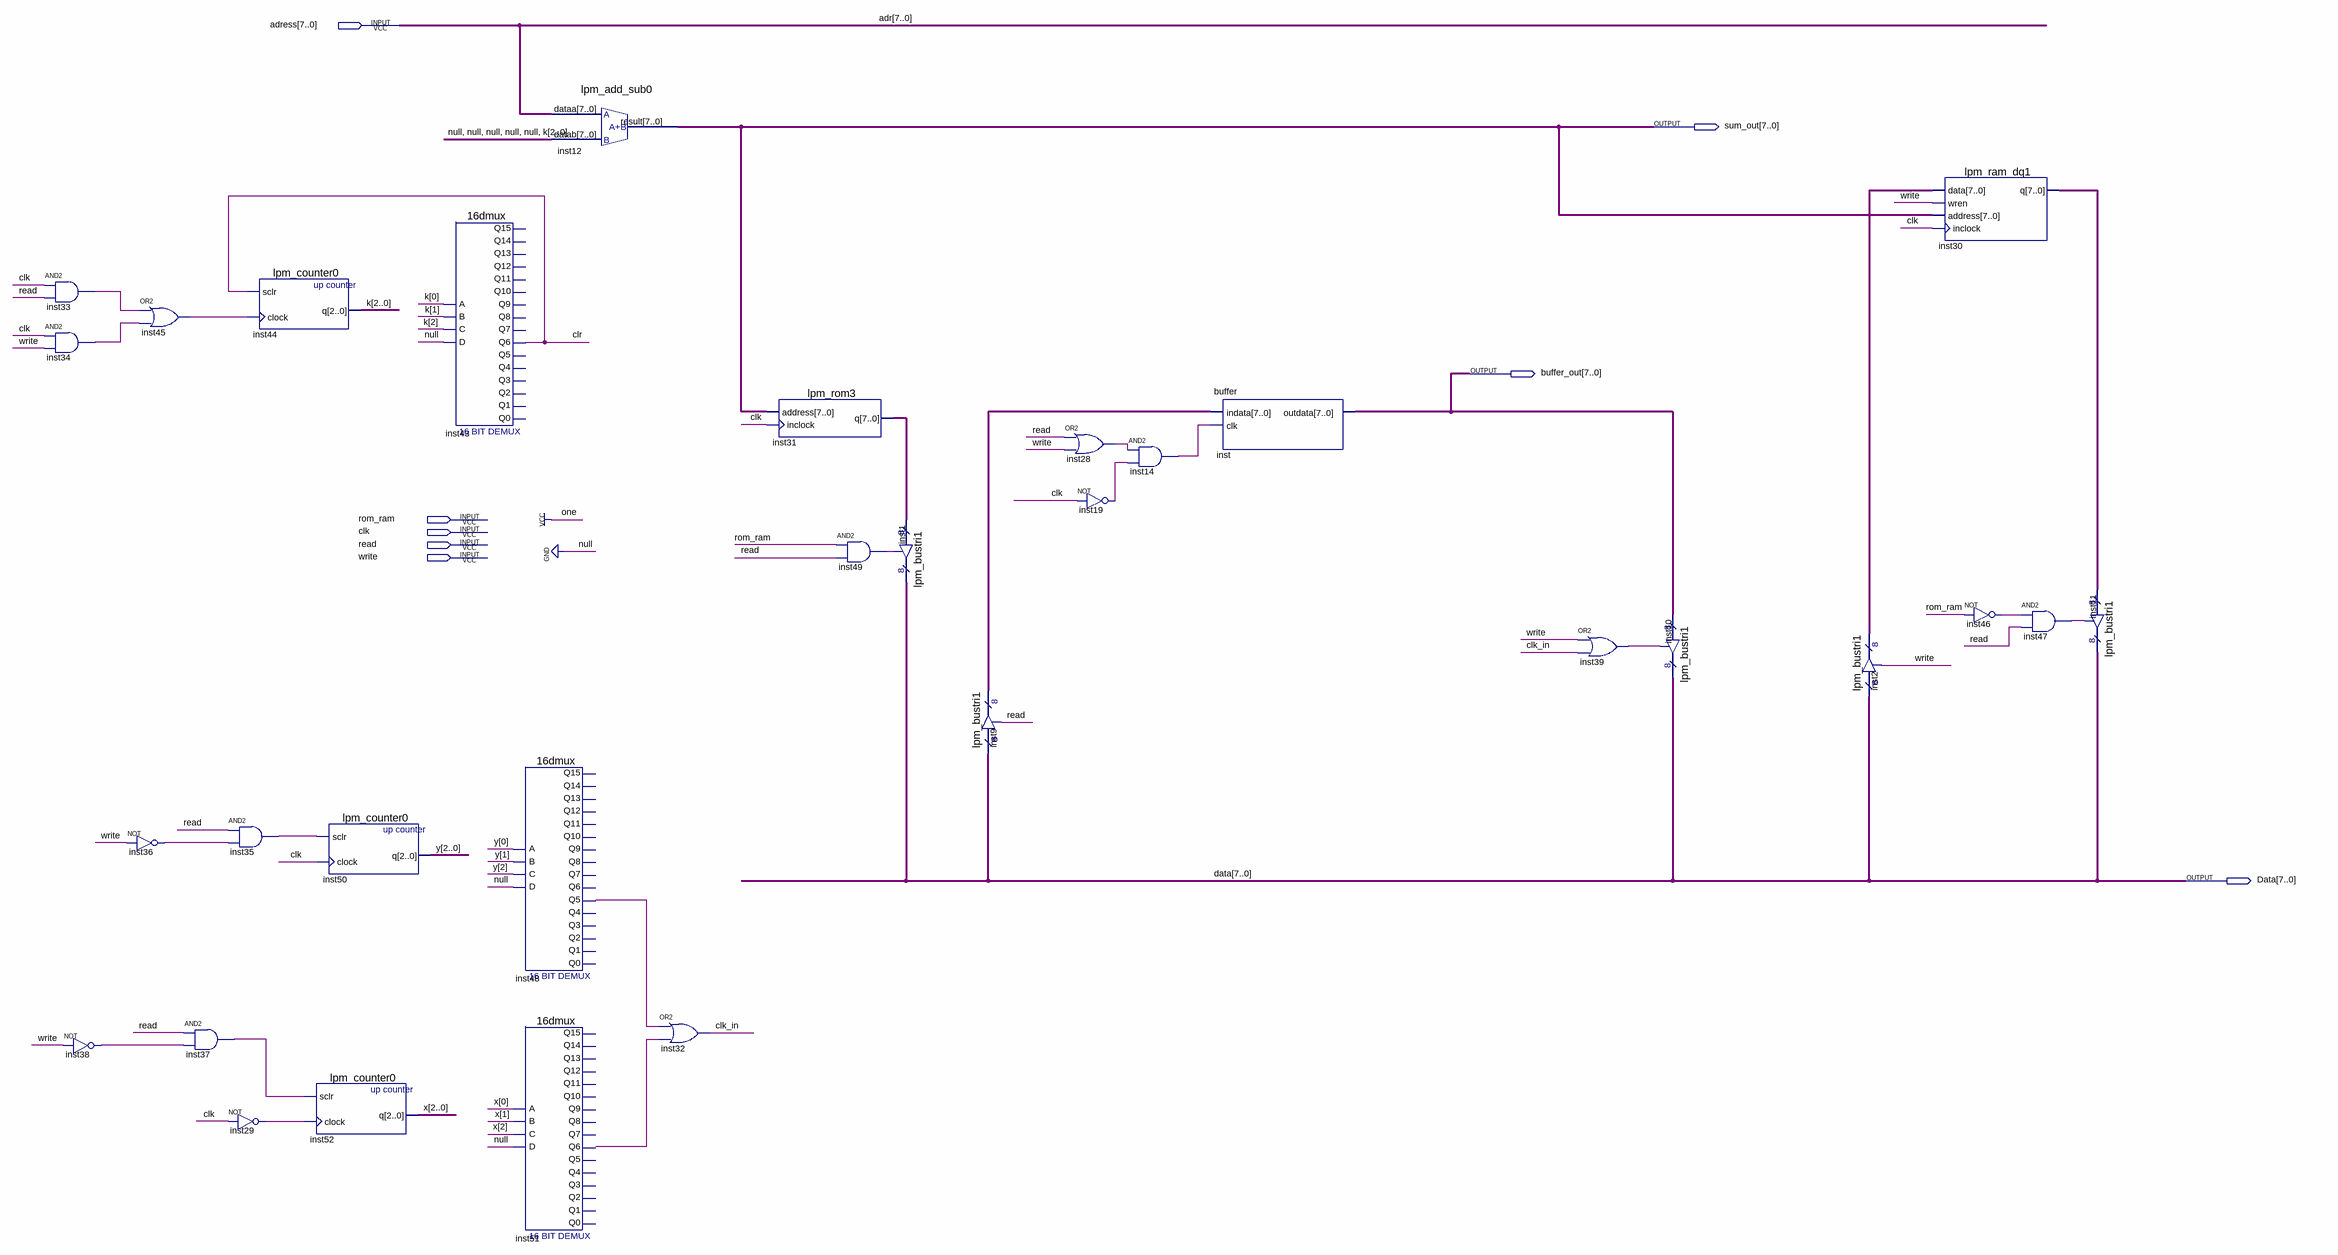
[diagram p0: schematic sheet]
// Quartus schematic lab3.bdf as structural Verilog: 31 symbols, 8 pins
module lab3 (
  input  [7:0] adress,
  input  rom_ram,
  input  clk,
  input  read,
  input  write,
  output [7:0] sum_out,
  output [7:0] buffer_out,
  output [7:0] Data
);

  wire clk_in, clr, inst14_out, inst19_out, inst28_out, inst29_out, inst33_out, inst34_out, inst35_out,
       inst36_out, inst37_out, inst38_out, inst39_out, inst45_out, inst46_out, inst47_out, inst48_q5,
       inst49_out, inst51_q6;
  wire [2:0] k, x, y;
  wire [7:0] inst2_tridata, inst9_tridata, inst30_q, inst31_q;

  and inst33 (inst33_out, clk, read);
  and inst34 (inst34_out, clk, write);
  not inst38 (inst38_out, write);
  or inst45 (inst45_out, inst33_out, inst34_out);
  not inst36 (inst36_out, write);
  and inst37 (inst37_out, read, inst38_out);
  and inst35 (inst35_out, read, inst36_out);
  not inst29 (inst29_out, clk);
  lpm_counter0 inst44 (.sclr(clr), .clock(inst45_out), .q(k));
  lpm_counter0 inst50 (.sclr(inst35_out), .clock(clk), .q(y));
  lpm_counter0 inst52 (.sclr(inst37_out), .clock(inst29_out), .q(x));
  \16dmux  inst43 (
    .C(k[2]), .B(k[1]), .A(k[0]), .D(1'b0), .Q6(clr));  // open: Q12, Q13, Q11, Q9, Q10, Q7, Q8, Q4, Q5, Q2, Q3, Q14, Q15, Q0, Q1
  \16dmux  inst48 (
    .C(y[2]), .B(y[1]), .A(y[0]), .D(1'b0), .Q5(inst48_q5));  // open: Q12, Q13, Q11, Q9, Q10, Q7, Q8, Q4, Q6, Q2, Q3, Q14, Q15, Q0, Q1
  \16dmux  inst51 (
    .C(x[2]), .B(x[1]), .A(x[0]), .D(1'b0), .Q6(inst51_q6));  // open: Q12, Q13, Q11, Q9, Q10, Q7, Q8, Q4, Q5, Q2, Q3, Q14, Q15, Q0, Q1
  lpm_add_sub0 inst12 (.dataa(adress), .datab({{5{1'b0}}, k}), .result(sum_out));
  or inst32 (clk_in, inst48_q5, inst51_q6);
  lpm_rom3 inst31 (.address(sum_out), .inclock(clk), .q(inst31_q));
  and inst49 (inst49_out, rom_ram, read);
  lpm_bustri1 inst1 (.enabledt(inst49_out), .data(inst31_q), .tridata(Data));
  lpm_bustri1 inst9 (.enabledt(read), .data(Data), .tridata(inst9_tridata));
  or inst28 (inst28_out, read, write);
  not inst19 (inst19_out, clk);
  and inst14 (inst14_out, inst28_out, inst19_out);
  buffer inst (.indata(inst9_tridata), .clk(inst14_out), .outdata(buffer_out));
  or inst39 (inst39_out, write, clk_in);
  lpm_bustri1 inst10 (.enabledt(inst39_out), .data(buffer_out), .tridata(Data));
  lpm_bustri1 inst2 (.enabledt(write), .data(Data), .tridata(inst2_tridata));
  lpm_ram_dq1 inst30 (.data(inst2_tridata), .wren(write), .address(sum_out), .inclock(clk), .q(inst30_q));
  not inst46 (inst46_out, rom_ram);
  and inst47 (inst47_out, inst46_out, read);
  lpm_bustri1 inst11 (.enabledt(inst47_out), .data(inst30_q), .tridata(Data));

  // Other names for the same wires on the sheet: adr[7:0] = adress
endmodule
